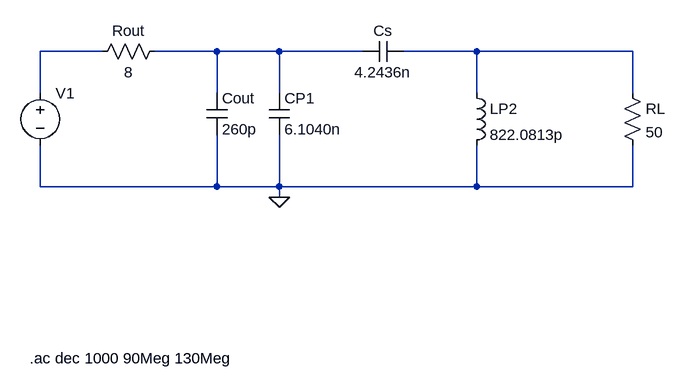
[diagram p0: schematic Ej_pi.asc]
Ej_pi.asc, the LTspice schematic file:
Version 4.1
SHEET 1 880 680
WIRE -192 112 -288 112
WIRE -16 112 -112 112
WIRE 80 112 -16 112
WIRE 208 112 80 112
WIRE 384 112 272 112
WIRE 624 112 384 112
WIRE -288 176 -288 112
WIRE -16 176 -16 112
WIRE 80 176 80 112
WIRE 384 176 384 112
WIRE 624 176 624 112
WIRE -288 320 -288 256
WIRE -16 320 -16 240
WIRE -16 320 -288 320
WIRE 80 320 80 240
WIRE 80 320 -16 320
WIRE 384 320 384 256
WIRE 384 320 80 320
WIRE 624 320 624 256
WIRE 624 320 384 320
WIRE 80 336 80 320
FLAG 80 336 0
SYMBOL voltage -288 160 R0
WINDOW 3 24 96 Invisible 2
WINDOW 39 0 0 Left 0
SYMATTR InstName V1
SYMATTR Value SINE(0 1 11G)
SYMATTR Value2 AC 1 0
SYMBOL cap 272 96 R90
WINDOW 0 0 32 VBottom 2
WINDOW 3 32 32 VTop 2
SYMATTR InstName Cs
SYMATTR Value 4.2436n
SYMBOL ind 368 160 R0
SYMATTR InstName LP2
SYMATTR Value 822.0813p
SYMBOL res 608 160 R0
SYMATTR InstName RL
SYMATTR Value 50
SYMBOL res -96 96 R90
WINDOW 0 0 56 VBottom 2
WINDOW 3 32 56 VTop 2
SYMATTR InstName Rout
SYMATTR Value 8
SYMBOL cap -32 176 R0
SYMATTR InstName Cout
SYMATTR Value 260p
SYMBOL cap 64 176 R0
SYMATTR InstName CP1
SYMATTR Value 6.1040n
TEXT -304 584 Left 2 !.ac dec 1000 90Meg 130Meg

The netlist it stands for:
* Ej_pi.asc
V1 N001 0 SINE(0 1 11G) AC 1 0
Cs N003 N002 4.2436n
LP2 N003 0 822.0813p
RL N003 0 50
Rout N002 N001 8
Cout N002 0 260p
CP1 N002 0 6.1040n
.ac dec 1000 90Meg 130Meg
.backanno
.end